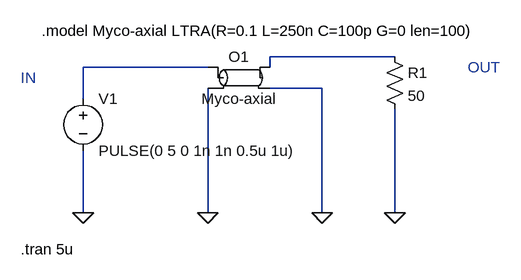
[diagram p0: schematic LTRA wala.asc]
LTRA wala.asc, the LTspice schematic file:
Version 4.1
SHEET 1 880 680
WIRE 480 80 288 80
WIRE 192 96 0 96
WIRE 288 96 288 80
WIRE 368 128 288 128
WIRE 0 144 0 96
WIRE 0 320 0 224
WIRE 192 320 192 128
WIRE 368 320 368 128
WIRE 480 320 480 160
FLAG 0 320 0
FLAG 192 320 0
FLAG 368 320 0
FLAG 480 320 0
SYMBOL voltage 0 128 R0
WINDOW 123 0 0 Left 0
WINDOW 39 0 0 Left 0
SYMATTR InstName V1
SYMATTR Value PULSE(0 5 0 1n 1n 0.5u 1u)
SYMBOL ltline 240 112 R0
SYMATTR InstName O1
SYMATTR Value Myco-axial
SYMBOL res 464 64 R0
SYMATTR InstName R1
SYMATTR Value 50
TEXT -64 40 Left 2 !.model Myco-axial LTRA(R=0.1 L=250n C=100p G=0 len=100)
TEXT -96 112 Left 2 ;IN
TEXT 592 96 Left 2 ;OUT
TEXT -96 376 Left 2 !.tran 5u

The netlist it stands for:
* LTRA wala.asc
V1 N002 0 PULSE(0 5 0 1n 1n 0.5u 1u)
O1 N002 0 N001 0 Myco-axial
R1 N001 0 50
.model Myco-axial LTRA(R=0.1 L=250n C=100p G=0 len=100)
* IN
* OUT
.tran 5u
.backanno
.end